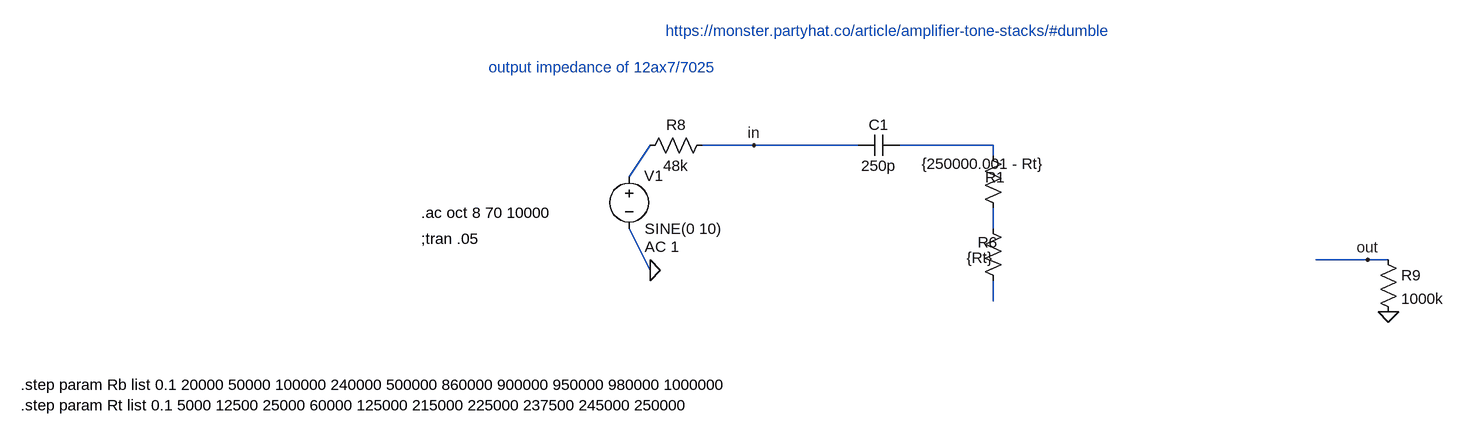
[diagram p0: schematic tone_garnet.asc]
tone_garnet.asc, the LTspice schematic file:
Version 4
SHEET 1 1168 1060
WIRE 96 80 16 80
WIRE 256 80 96 80
WIRE 464 80 320 80
WIRE 464 96 464 80
WIRE -96 128 -64 80
WIRE 464 208 464 176
WIRE 1040 256 960 256
WIRE 1072 256 1040 256
WIRE -64 272 -96 208
WIRE 464 320 464 288
FLAG -64 272 0
FLAG 1040 256 out
FLAG 96 80 in
FLAG 1072 336 0
SYMBOL voltage -96 112 R0
WINDOW 123 24 124 Left 2
WINDOW 39 0 0 Left 0
WINDOW 0 23 15 Left 2
SYMATTR Value2 AC 1
SYMATTR InstName V1
SYMATTR Value SINE(0 10)
SYMBOL res 448 80 R0
WINDOW 3 -94 28 Left 2
WINDOW 0 4 49 Left 2
SYMATTR Value {250000.001 - Rt}
SYMATTR InstName R1
SYMBOL res 448 192 R0
WINDOW 3 -25 61 Left 2
WINDOW 0 -8 37 Left 2
SYMATTR Value {Rt}
SYMATTR InstName R6
SYMBOL res 32 64 R90
WINDOW 0 0 56 VBottom 2
WINDOW 3 32 56 VTop 2
SYMATTR InstName R8
SYMATTR Value 48k
SYMBOL res 1056 240 R0
SYMATTR InstName R9
SYMATTR Value 1000k
SYMBOL cap 320 64 R90
WINDOW 0 0 32 VBottom 2
WINDOW 3 32 32 VTop 2
SYMATTR InstName C1
SYMATTR Value 250p
TEXT -416 224 Left 2 !;tran .05
TEXT -416 184 Left 2 !.ac oct 8 70 10000
TEXT -1032 448 Left 2 !.step param Rb list 0.1 20000 50000 100000 240000 500000 860000 900000 950000 980000 1000000
TEXT -1032 480 Left 2 !.step param Rt list 0.1 5000 12500 25000 60000 125000 215000 225000 237500 245000 250000
TEXT -40 -96 Left 2 ;https://monster.partyhat.co/article/amplifier-tone-stacks/#dumble
TEXT -312 -40 Left 2 ;output impedance of 12ax7/7025

The netlist it stands for:
* tone_garnet.asc
V1 N002 0 SINE(0 10) AC 1
R1 N001 N003 {250000.001 - Rt}
R6 N003 N004 {Rt}
R8 in N002 48k
R9 out 0 1000k
C1 N001 in 250p
;tran .05
.ac oct 8 70 10000
.step param Rb list 0.1 20000 50000 100000 240000 500000 860000 900000 950000 980000 1000000
.step param Rt list 0.1 5000 12500 25000 60000 125000 215000 225000 237500 245000 250000
* https://monster.partyhat.co/article/amplifier-tone-stacks/#dumble
* output impedance of 12ax7/7025
.backanno
.end